# Altium schematic sheet Sensors.SchDoc
size A4; SheetNumber: 1; SheetTotal: 3
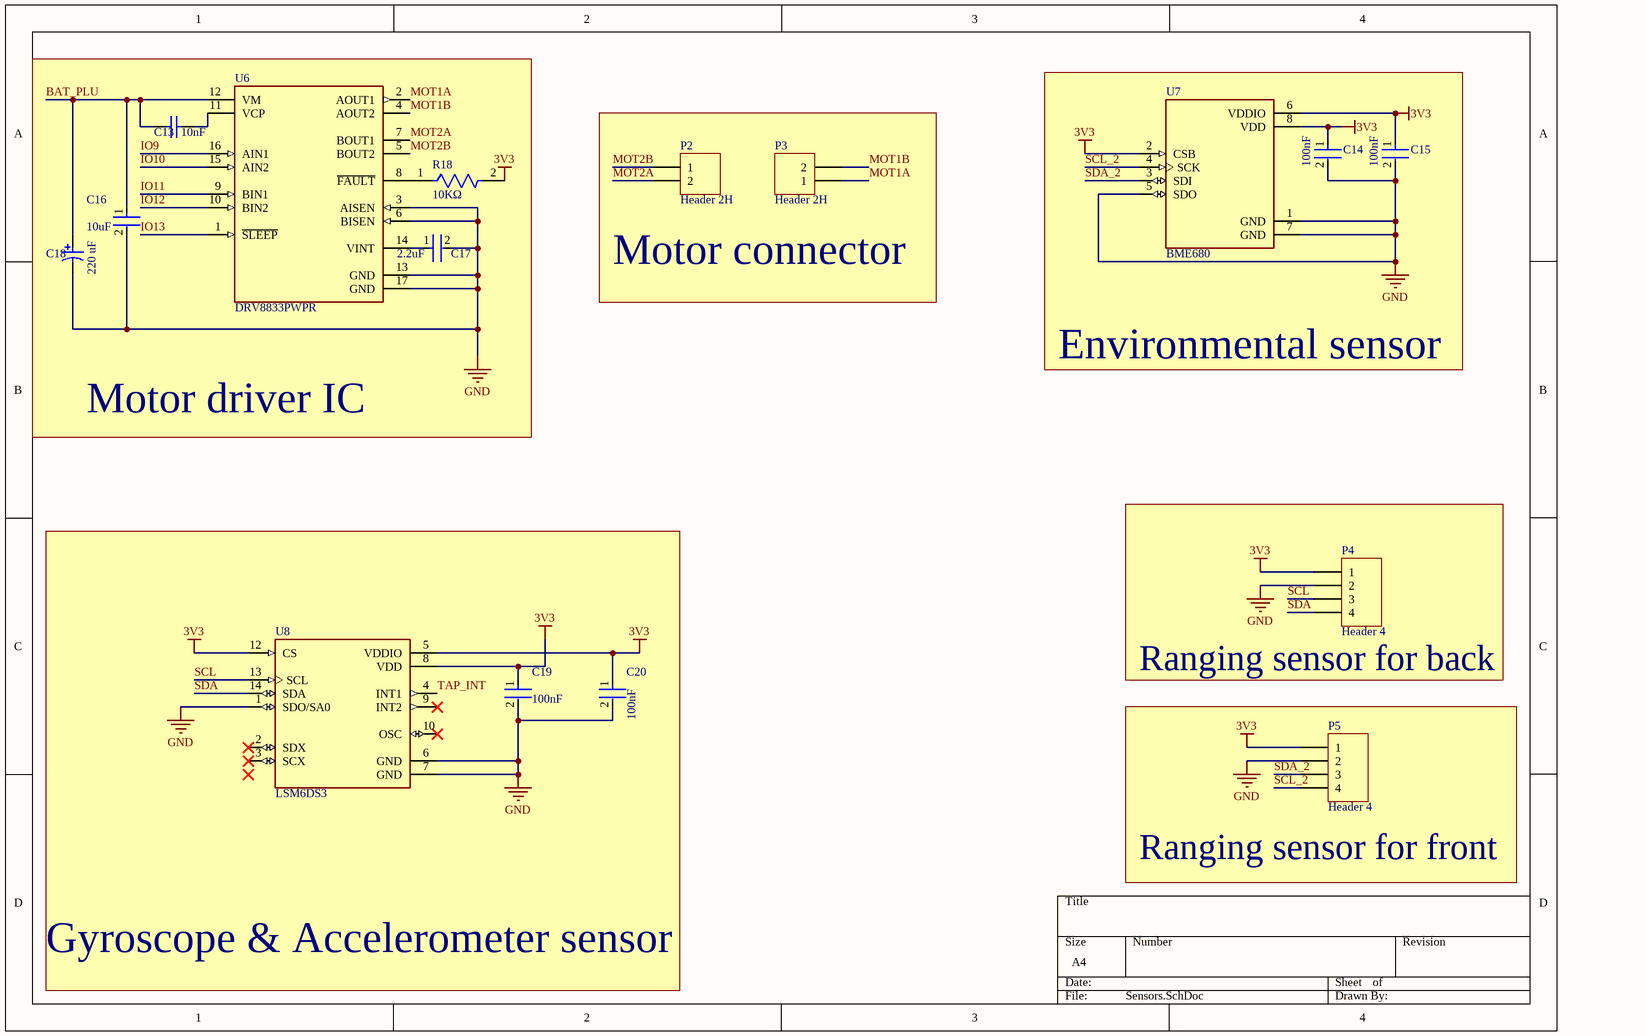
[diagram p0: Sensors.SchDoc]

## Parts
C13  value 10nF  [CAPC0805(2012)145_N]  (hidden comment: CAP 10nF 50V 0805(2012))
C14  Capacitance: 100nF  [FP-CC0805-EB-IPC_B]  (hidden comment: CC0805KKX7RYBB104)
C15  Capacitance: 100nF  [FP-CC0805-EB-IPC_B]  (hidden comment: CC0805KKX7RYBB104)
C16  Capacitance: 10uF  [FP-C0805C106J8RACAUTO-MFG]  (hidden comment: C0805C106J8RACAUTO)
C17  Capacitance: 2.2uF  [FP-0805-L_2_01_0_2-W_1_25-MFG]  (hidden comment: 08053C225K4Z2A)
C18  Rated Capacitance: 220 uF  [NIC-CAPA2-8X10_V]  (hidden comment: UUD1V221MNL1GS)
C19  Capacitance: 100nF  [FP-CC0805-EB-IPC_B]  (hidden comment: CC0805KKX7RYBB104)
C20  Capacitance: 100nF  [FP-CC0805-EB-IPC_B]  (hidden comment: CC0805KKX7RYBB104)
P2  Header 2H  [HDR1X2H]
P3  Header 2H  [HDR1X2H]
P4  Header 4  [HDR1X4]
P5  Header 4  [HDR1X4]
R18  value 10KΩ  [FP-RT0805-IPC_B]  (hidden comment: RT0805FRD0710KL)
U6  DRV8833PWPR  [FP-PWP0016C-IPC_B]
U7  BME680  [PSON80P300X300X100-8N]
U8  LSM6DS3  [PQFN50P300X250X86-14N]

## Blocks framed on the sheet
Motor driver IC: C13 C16-C18 R18 U6
Environmental sensor: C14 C15 U7
Motor connector: P2 P3
Ranging sensor for back: P4
Gyroscope & Accelerometer sensor: C19 C20 U8
Ranging sensor for front: P5

## Nets
3V3: C14.1 C15.1 C19.1 C20.1 P4.1 P5.1 R18.2 U7.2(CSB) U7.6(VDDIO) U7.8(VDD) U8.5(VDDIO) U8.8(VDD) U8.12(CS)
GND: C14.2 C15.2 C16.2 C17.2 C18.2 C19.2 C20.2 P4.2 P5.2 U6.3(AISEN) U6.6(BISEN) U6.13(GND) U6.17(GND) U7.1(GND) U7.5(SDO) U7.7(GND) U8.1(SDO/SA0) U8.6(GND) U8.7(GND)
BAT_PLU: C13.1 C16.1 C18.1 U6.12(VM)
IO9: U6.16(AIN1)
IO10: U6.15(AIN2)
IO11: U6.9(BIN1)
IO12: U6.10(BIN2)
IO13: U6.1(~{SLEEP})
MOT1A: P3.1 U6.2(AOUT1)
MOT1B: P3.2 U6.4(AOUT2)
MOT2A: P2.2 U6.7(BOUT1)
MOT2B: P2.1 U6.5(BOUT2)
SCL: P4.3 U8.13(SCL)
SCL_2: P5.4 U7.4(SCK)
SDA: P4.4 U8.14(SDA)
SDA_2: P5.3 U7.3(SDI)
TAP_INT: U8.4(INT1)
NetC13_2: C13.2 U6.11(VCP)
NetC17_1: C17.1 U6.14(VINT)
NetR18_1: R18.1 U6.8(~{FAULT})

Not connected (* = marked no-connect by the designer): U8 2(SDX)* 3(SCX)* 9(INT2)* 10(OSC)*

## Library data of the parts
C13 = CMP-1036-03843-1: CAP 10nF 50V ±10% 0805 (2012 Metric) Thickness 1.45mm SMD; Case-EIA: 0805; Tolerance: Â±10%; Case-Metric: 2012; Technology: SMT; Max Thickness: 1.45 mm; Rated Voltage: 50 V; LCSC Part: C377773
C14 C15 C19 C20 = CMP-00621-107850848-1: CC0805KKX7RYBB104 Capacitor Ceramic 0.01uF 250V X7R 10% 0805 T/R; Material: Ceramic; Max Operating Temperature: 125°C; Tolerance: 10%; Case/Package: 0805; NexarPartId: 107850848; Height: 1.45mm; Min Operating Temperature: -55°C; Voltage Rating: 250V; LCSC Part: C28233
C16 = CMP-03020-034708-1: CAP CER 10UF 10V X7R 0805; Tolerance: 5%; Mount: Surface Mount; Voltage Rating: 10V; Max Operating Temperature: 125°C; Min Operating Temperature: -55°C; Case/Package: 0805; RoHS Compliant: Yes; Packaging: Tape and Reel; Case Code (Imperial): 0805; Case Code (Metric): 2012; Ratings: AEC-Q200; LCSC Part: C15850
C17 = CMP-04427-000048-1: CAP CER 2.2UF 25V X7R 0805; Tolerance: 10%; Voltage Rating: 25V; Packaging: Tape and Reel; Case/Package: 0805; Case Code (Imperial): 0805; Max Operating Temperature: 125°C; Features: Soft Termination; Ratings: AEC-Q200; Mount: Surface Mount; Case Code (Metric): 2012; Min Operating Temperature: -55°C; LCSC Part: C377773
C18 = CMP-0687-00080-1: Aluminum Electrolytic Capacitor, UD Series, Low Impedance, 220 uF, 35 V, + / - 20%, -55 to 105 degC, Chip Type, 8 x 10 mm D x L, Pb-Free, Reel; Manufacturer: Nichicon; Tolerance Rated Capacitance: -20 to 20%; Rated Voltage: 35 V; Packing: Dia382mm Reel; Impedance: 0.17 Ohm; Endurance Time: 5000 h; Rated Ripple Current (at 100kHz): 450 mA; ComponentLink3URL: http://products.nichicon.co.jp/en/pdf/XJA043/e-ud.pdf; DatasheetVersion: 08/2012; PackageDescription: 2-Pin Surface Mount Device, Diameter 8 mm, Height 10 mm, Pitch 6.5 mm; Length: 10 mm; ComponentLink3Description: Package Specification; RoHS: TRUE; ComponentLink1URL: http://www.nichicon.co.jp/; PartNumber: UUD1V221MNL1GS; ComponentLink2Description: Datasheet; ComponentLink2URL: http://products.nichicon.co.jp/en/pdf/XJA043/e-ud.pdf; PackageReference: CAPAE-D8H10; Diameter: 8 mm; Mounting Technology: Surface Mount; ComponentLink1Description: Manufacturer URL; LCSC Part: C2836441
P2 P3 = Header 2H: Header, 2-Pin, Right Angle; LatestRevisionDate: 17-Jul-2002; LatestRevisionNote: Re-released for DXP Platform.; Publisher: Altium Limited; LCSC Part: C32713261
P4 P5 = Header 4: Header, 4-Pin; LatestRevisionDate: 17-Jul-2002; LatestRevisionNote: Re-released for DXP Platform.; Publisher: Altium Limited; LCSC Part: C42431787
R18 = CMP-03412-035478-1: RES SMD 10K OHM 1% 1/8W 0805; Manufacturer: Yageo; Tolerance: 0.0001; Temperature Coefficient: 25 ppm/°C; Power Rating: 0.125W; Voltage Rating: 150V; RoHS: TRUE; Footprint Url: http://www.yageo.com/exep/pages/download/literatures/PYu-R_Mount_10.pdf; Series: RT; Octopart: https://octopart.com/rt0805frd0710kl-yageo-71399701; Digikey Description: RES SMD 10K OHM 1% 1/8W 0805; Composition: Thin Film; Manufacturer Part Number: RT0805FRD0710KL; Device Class L1: Passive Components; Automotive: No; ComponentLink2Description: Datasheet; Ipc Land Pattern Name: RESC200125X50; Device Class L2: Resistors; Resistance: 10KΩ; Temperature Range Low: -55°C; Device Class L3: Chip SMD Resistors; ComponentLink2URL: http://www.yageo.com/documents/recent/PYu-RT_1-to-0.01_RoHS_L_9.pdf; Temperature: -55°C to +155°C; Category: Res; Temperature Range High: +155°C; Lead Free: Yes; Package: RT0805; Height: 0.6mm; LCSC Part: C17414
U6 = CMP-1529-00004-3: IC MOTOR DRIVER PAR 16HTSSOP; Supply Current: 3mA; Max Output Current: 2A; Interface: PWM; Output Current: 1.5A; Max Supply Voltage: 10.8V; Fault Protection: Over Temperature; Number of Outputs: 2; Min Supply Voltage: 2.7V; Nominal Supply Current: 3mA; Series: DRV8833; Min Operating Temperature: -40°C; Package Quantity: 2000; Packaging: Tape and Reel; Case/Package: HTSSOP; Output Current per Channel: 1.5A; RoHS Compliant: Yes; RMS Current (Irms): 1.5A; Max Operating Temperature: 85°C; Technology: NMOS; Number of Pins: 16; Radiation Hardening: No; Lead Free: Lead Free; REACH SVHC: No SVHC; LCSC Part: C50506
U7 = BME680: Gas, Humidity, Pressure, Temperature Sensor I2C, SPI Output; MF: Bosch Sensortec; SnapEDA_Link: https://www.snapeda.com/parts/BME680/Bosch+Sensortec/view-part/?ref=snap; Package: LGA-8 Bosch Tools; Value: *; MP: BME680; Check_prices: https://www.snapeda.com/parts/BME680/Bosch+Sensortec/view-part/?ref=eda; LCSC Part: C125972
U8 = LSM6DS3: Accelerometer, Gyroscope, Temperature, 6 Axis Sensor IÂ²C, SPI Output; MF: STMicroelectronics; Value: *; SnapEDA_Link: https://www.snapeda.com/parts/LSM6DS3/STMicroelectronics/view-part/?ref=snap; MP: LSM6DS3; Check_prices: https://www.snapeda.com/parts/LSM6DS3/STMicroelectronics/view-part/?ref=eda; Purchase-URL: https://pricing.snapeda.com/search/part/LSM6DS3/?ref=eda; Availability: In Stock; Price: None; Package: Package; LCSC Part: LSM6DS3TR-C